# EAGLE design Gateway HUB (EAGLE 9.6.2)
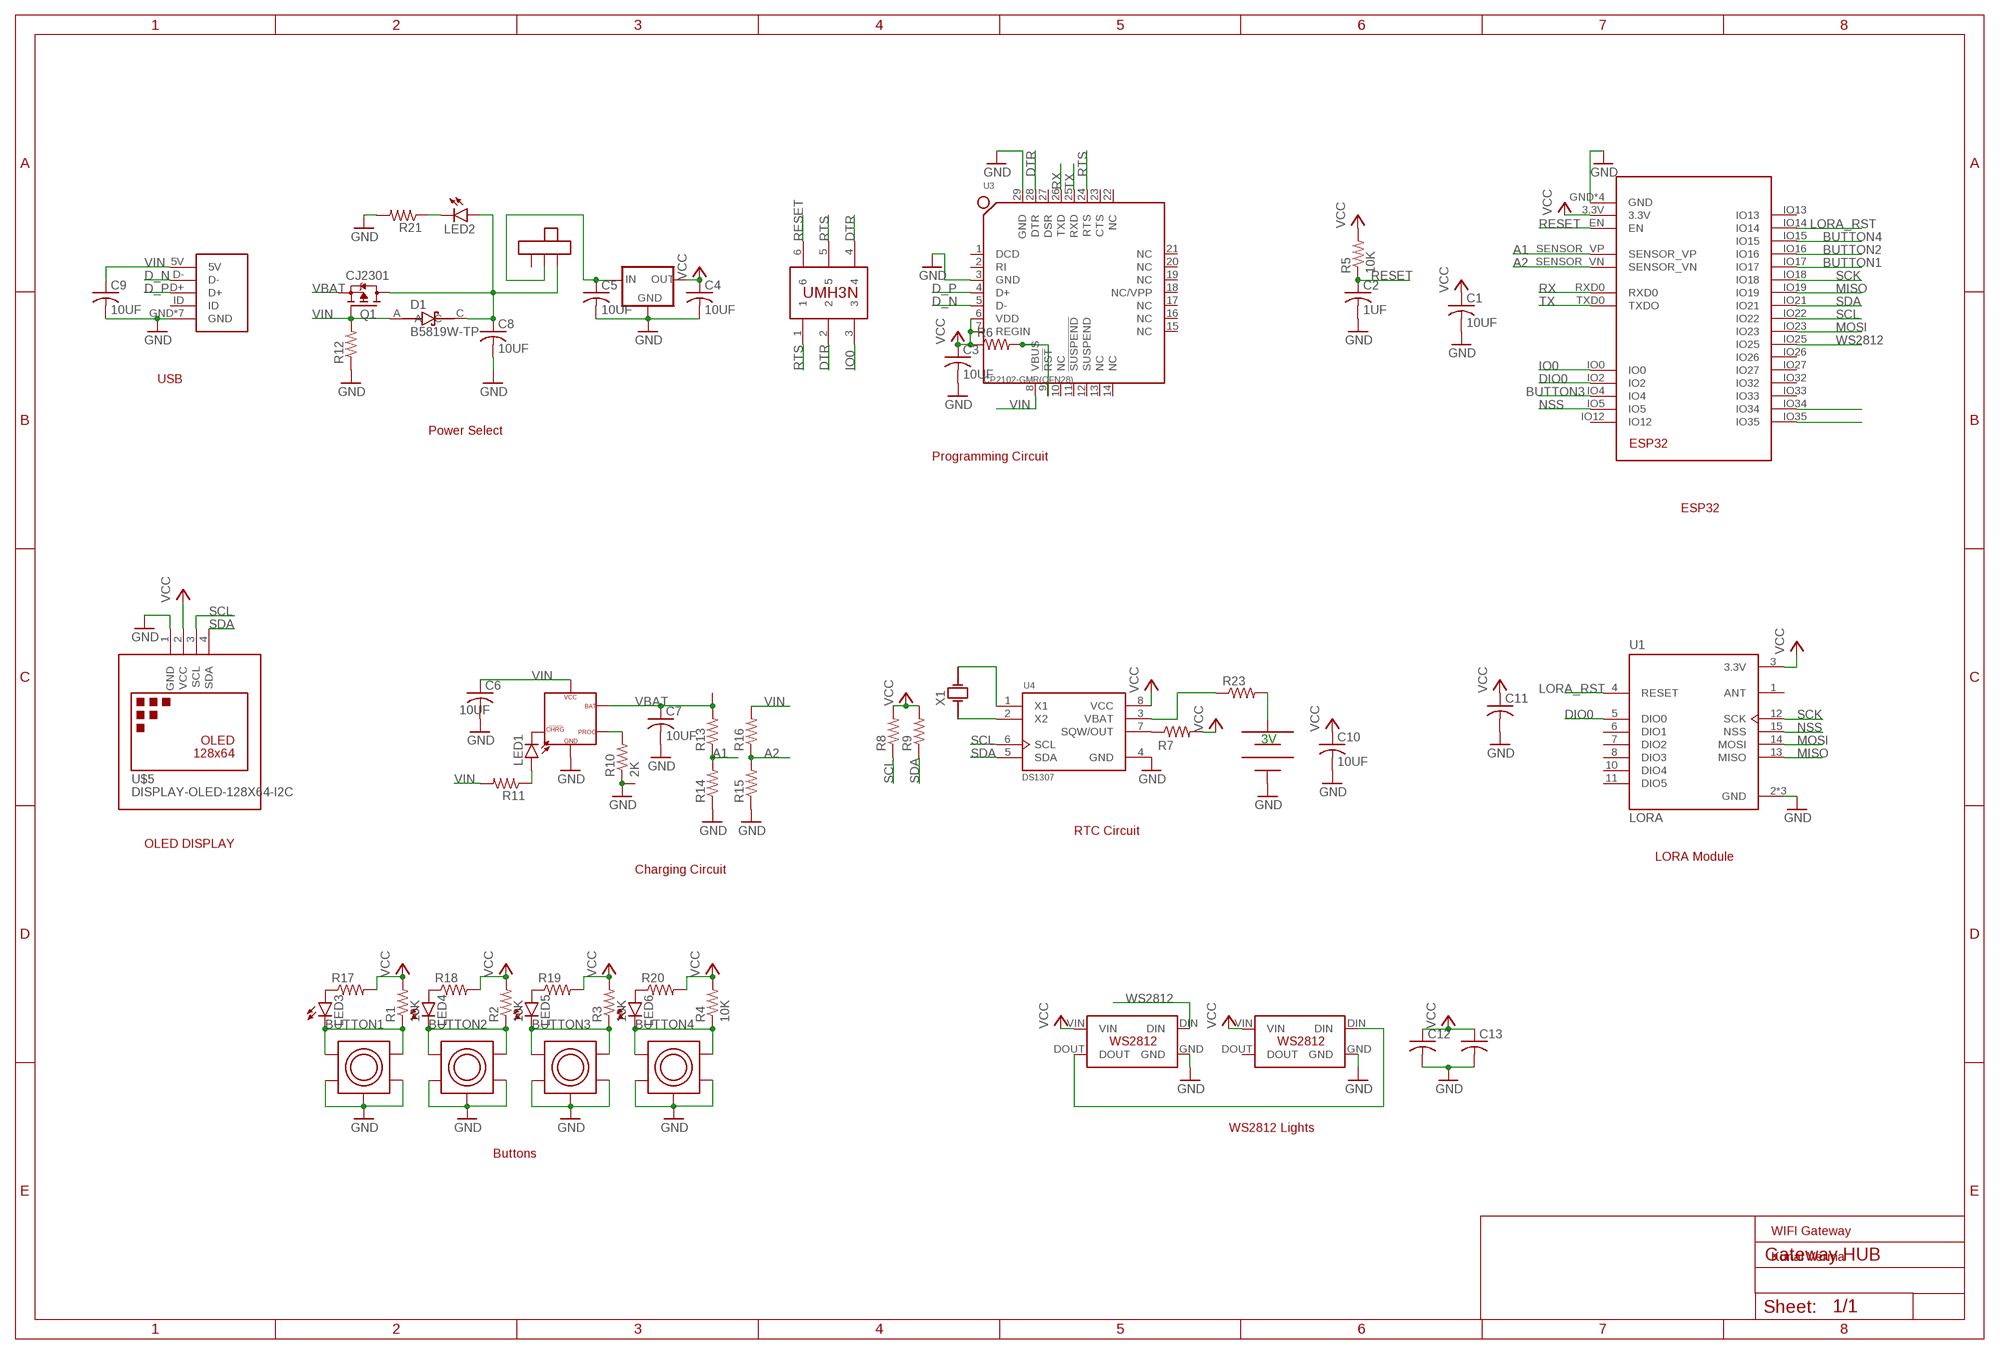
[diagram p0: schematic, sheet 1]

## Parts
C1  10UF  C-USC0603  [C0603]
C2  1UF  C-USC0603  [C0603]
C3  10UF  C-USC0603  [C0603]
C4  10UF  C-USC0603  [C0603]
C5  10UF  C-USC0603  [C0603]
C6  10UF  C-USC0603  [C0603]
C7  10UF  C-USC0603  [C0603]
C8  10UF  C-USC0603  [C0603]
C9  10UF  C-USC0603  [C0603]
C10  10UF  C-USC0603  [C0603]
C11  C-USC0603  [C0603]
C12  C-USC0603  [C0603]
C13  C-USC0603  [C0603]
D1  B5819W-TP  [SOD3716X135N]
IC1  V_REG3.3MP  [SOT223]
LED1  LEDSML0603  [SML0603]
LED2  LEDSML0603  [SML0603]
LED3  LEDSML0603  [SML0603]
LED4  LEDSML0603  [SML0603]
LED5  LEDSML0603  [SML0603]
LED6  LEDSML0603  [SML0603]
Q1  CJ2301  [SOT95P230X110-3N]
R1  10K  R-US_R0603  [R0603]
R2  10K  R-US_R0603  [R0603]
R3  10K  R-US_R0603  [R0603]
R4  10K  R-US_R0603  [R0603]
R5  10K  R-US_R0603  [R0603]
R6  R-US_R0603  [R0603]
R7  R-US_R0603  [R0603]
R8  R-US_R0603  [R0603]
R9  R-US_R0603  [R0603]
R10  2K  R-US_R0603  [R0603]
R11  R-US_R0603  [R0603]
R12  R-US_R0603  [R0603]
R13  R-US_R0603  [R0603]
R14  R-US_R0603  [R0603]
R15  R-US_R0603  [R0603]
R16  R-US_R0603  [R0603]
R17  R-US_R0603  [R0603]
R18  R-US_R0603  [R0603]
R19  R-US_R0603  [R0603]
R20  R-US_R0603  [R0603]
R21  R-US_R0603  [R0603]
R23  R-US_R0603  [R0603]
U1  LORA  [XCVR_RA-01H]
U2  ESP32  [MODULE_ESP-WROOM-32]
U3  CP2102-GMR(QFN28)  [QFN28G_0.5-5X5MM]
U4  DS1307  [SOIC127P600X175-8N]
U5  TP4054  [SOT23-3]
U$1  PUSHBUTTON  [B3W-4105]
U$2  PUSHBUTTON  [B3W-4105]
U$3  PUSHBUTTON  [B3W-4105]
U$4  PUSHBUTTON  [B3W-4105]
U$5  DISPLAY-OLED-128X64-I2C  [DISPLAY-OLED-128X64-I2C]
U$6  COIN_CELL_HOLDER  [CR2032-BS-6-1]
U$7  UMH3N  [UMH3N]
U$8  MICROUSB  [USB]
U$9  SELF-TOOGLE-SWITCH  [SELF-TOOGLE-SWITCH]
U$10  PAD  [PADS]
U$11  PAD  [PADS]
U$12  WS2812SMD-2020  [SMD-2020]
U$13  WS2812SMD-2020  [SMD-2020]
X1  CRYSTAL_38T-32.768KHZ  [XTAL_AB38T-32.768KHZ]

## Nets
A1: R13.1 R14.2 U2.SENSOR_VP
A2: R15.2 R16.1 U2.SENSOR_VN
BUTTON1: LED3.C R1.1 U2.IO17 U$1.P$1 U$1.P$4
BUTTON2: LED4.C R2.1 U2.IO16 U$2.P$1 U$2.P$4
BUTTON3: LED5.C R3.1 U2.IO4 U$3.P$1 U$3.P$4
BUTTON4: LED6.C R4.1 U2.IO15 U$4.P$1 U$4.P$4
D_N: U3.5(D-) U$8.D-
D_P: U3.4(D+) U$8.D+
DIO0: U1.5(DIO0) U2.IO2
DTR: U3.28(DTR) U$7.2 U$7.4
GND: C1.2 C2.2 C3.2 C4.2 C5.2 C6.2 C7.2 C8.2 C9.2 C10.2 C11.2 C12.2 C13.2 IC1.GND R10.1 R12.1 R14.1 R15.1 R21.2 U1.2(GND) U1.9(GND) U1.16(GND) U2.GND U2.GND1(GND) U2.GND2(GND) U2.GND3(GND) U3.3(GND) U3.29(GND) U4.4(GND) U5.2 U$1.P$2 U$1.P$3 U$1.P$5 U$2.P$2 U$2.P$3 U$2.P$5 U$3.P$2 U$3.P$3 U$3.P$5 U$4.P$2 U$4.P$3 U$4.P$5 U$5.1(GND) U$6.- U$8.GND U$8.GND1(GND) U$8.GND2(GND) U$8.GND3(GND) U$8.GND4(GND) U$8.GND5(GND) U$8.GND6(GND) U$11.P$1 U$12.GND U$13.GND
IO0: U2.IO0 U$7.3
LORA_RST: U1.4(RESET) U2.IO14
MISO: U1.13(MISO) U2.IO19
MOSI: U1.14(MOSI) U2.IO23
N$1: R23.1 U4.3(VBAT)
N$2: R6.2 U3.9(!RST)
N$3: U2.IO34
N$4: U2.IO35
N$5: R7.1 U4.7(SQW/OUT)
N$6: C5.1 IC1.VIN(IN) U$9.2
N$7: U4.2(X2) X1.1
N$8: U4.1(X1) X1.2
N$9: R10.2 U5.5
N$10: LED1.C U5.1
N$11: C8.1 D1.C LED2.A Q1.3(D) U$9.3
N$12: LED1.A R11.1
N$13: LED3.A R17.1
N$14: LED4.A R18.1
N$15: LED5.A R19.1
N$16: LED6.A R20.1
N$17: LED2.C R21.1
N$18: U$12.DOUT U$13.DIN
N$19: R23.2 U$6.+
NSS: U1.15(NSS) U2.IO5
RESET: C2.1 R5.1 U2.EN U$7.6
RTS: U3.24(RTS) U$7.1 U$7.5
RX: U2.RXD0 U3.26(TXD)
SCK: U1.12(SCK) U2.IO18
SCL: R8.1 U2.IO22 U4.6(SCL) U$5.3(SCL)
SDA: R9.1 U2.IO21 U4.5(SDA) U$5.4(SDA)
TX: U2.TXD0(TXDO) U3.25(RXD)
VBAT: C7.1 Q1.2(S) R13.2 U5.3 U$10.P$1
VCC: C1.1 C3.1 C4.1 C10.1 C11.1 C12.1 C13.1 IC1.VOUT1(OUT) IC1.VOUT(OUT) R1.2 R2.2 R3.2 R4.2 R5.2 R6.1 R7.2 R8.2 R9.2 R17.2 R18.2 R19.2 R20.2 U1.3(3.3V) U2.3.3V U3.6(VDD) U3.7(REGIN) U4.8(VCC) U$5.2(VCC) U$12.VIN U$13.VIN
VIN: C6.1 C9.1 D1.A Q1.1(G) R11.2 R12.2 R16.2 U3.8(VBUS) U5.4 U$8.5V
WS2812: U2.IO25 U$12.DIN
Unconnected: U1.1(ANT) U1.6(DIO1) U1.7(DIO2) U1.8(DIO3) U1.10(DIO4) U1.11(DIO5) U2.IO12 U2.IO13 U2.IO26 U2.IO27 U2.IO32 U2.IO33 U3.1(DCD) U3.2(RI) U3.10(NC) U3.11(!SUSPEND) U3.12(SUSPEND) U3.13(NC) U3.14(NC) U3.15(NC) U3.16(NC) U3.17(NC) U3.18(NC/VPP) U3.19(NC) U3.20(NC) U3.21(NC) U3.22(NC) U3.23(CTS) U3.27(DSR) U$8.ID U$9.1 U$13.DOUT

## Notes on the sheet
- USB
- Power Select
- Programming Circuit
- ESP32
- 3V
- RTC Circuit
- OLED DISPLAY
- LORA Module
- Charging Circuit
- WS2812 Lights
- Buttons
- WIFI Gateway
- Kunal Verma

## Library data of the parts
C1-C13 = rcl:C-US: CAPACITOR, American symbol; SPICEPREFIX: C
D1 = B5819W-TP:B5819W-TP: Diode Schottky 20v 1a Sod123 Check availability <https://pricing.snapeda.com/parts/B5819W-TP/Micro%20Commercial/view-part?ref=eda>; AVAILABILITY: In Stock; DESCRIPTION: Diode Schottky 40 V 1A Surface Mount SOD-123; MF: Micro Commercial; MP: B5819W-TP; PACKAGE: SOD-123 Multicomp; PRICE: None; PURCHASE-URL: https://pricing.snapeda.com/search/part/B5819W-TP/?ref=eda
IC1 = V_REG:V_REG: 800mA Low-Dropout Linear Regulator Source: http://www.ti.com/lit/ds/symlink/lm1117-n.pdf; MF: Texas Instruments; MPN: LM1117MP-3.3; OC_FARNELL: 9778195; OC_NEWARK: 28X3416
LED1-LED6 = led:LED: LED OSRAM: - CHIPLED LG R971, LG N971, LY N971, LG Q971, LY Q971, LO R971, LY R971 LH N974, LH R974 LS Q976, LO Q976, LY Q976 LO Q996 - Hyper CHIPLED LW Q18S LB Q993, LB Q99A, LB R99A - SideLED LS A670, LO A670, LY A670, LG A670, LP A670 LB A673, LV A673, LT A673, LW A673 LH A674 LY A675 LS A676, LA A676, LO A676, LY A676, LW A676 LS A679, LY A679, LG A679 - Hyper Micro SIDELED® LS Y876, LA Y876, LO Y876, LY Y876 LT Y87S - SmartLED LW L88C, LW L88S LB L89C, LB L89S, LG L890 LS L89K, LO L89K, LY L89K LS L896, LA L896, LO L896, LY L896 - TOPLED LS T670, LO T670, LY T670, LG T670, LP T670 LSG T670, LSP T670, LSY T670, LOP T670, LYG T670 LG T671, LOG T671, LSG T671 LB T673, LV T673, LT T673, LW T673 LH T674 LS T676, LA T676, LO T676, LY T676, LB T676, LH T676, LSB T676, LW T676 LB T67C, LV T67C, LT T67C, LS T67K, LO T67K, LY T67K, LW E67C LS E67B, LA E67B, LO E67B, LY E67B, LB E67C, LV E67C, LT E67C LW T67C LS T679, LY T679, LG T679 LS T770, LO T770, LY T770, LG T770, LP T770 LB T773, LV T773, LT T773, LW T773 LH T774 LS E675, LA E675, LY E675, LS T675 LS T776, LA T776, LO T776, LY T776, LB T776 LHGB T686 LT T68C, LB T68C - Hyper Mini TOPLED® LB M676 - Mini TOPLED Santana® LG M470 LS M47K, LO M47K, LY M47K Source: http://www.osram.convergy.de LUXEON: - LUMILED® LXK2-PW12-R00, LXK2-PW12-S00, LXK2-PW14-U00, LXK2-PW14-V00 LXK2-PM12-R00, LXK2-PM12-S00, LXK2-PM14-U00 LXK2-PE12-Q00, LXK2-PE12-R00, LXK2-PE12-S00, LXK2-PE14-T00, LXK2-PE14-U00 LXK2-PB12-K00, LXK2-PB12-L00, LXK2-PB12-M00, LXK2-PB14-N00, LXK2-PB14-P00, LXK2-PB14-Q00 LXK2-PR12-L00, LXK2-PR12-M00, LXK2-PR14-Q00, LXK2-PR14-R00 LXK2-PD12-Q00, LXK2-PD12-R00, LXK2-PD12-S00 LXK2-PH12-R00, LXK2-PH12-S00 LXK2-PL12-P00, LXK2-PL12-Q00, LXK2-PL12-R00 Source: www.luxeon.com KINGBRIGHT: KA-3528ASYC Source: www.kingbright.com
Q1 = PMV65XP_215:CJ2301: Single P-Channel 20 V 833 mW 7.7 nC Silicon Surface Mount Mosfet - SOT-23 Check availability <https://pricing.snapeda.com/parts/PMV65XP%2C215/Nexperia%20USA%20Inc./view-part?ref=eda>; AVAILABILITY: In Stock; DESCRIPTION: P-Channel 20 V 2.8A (Ta) 480mW (Ta) Surface Mount TO-236AB; MF: Nexperia USA Inc.; MP: PMV65XP,215; PACKAGE: SOT23-3 Nexperia USA Inc.; PRICE: None; PURCHASE-URL: https://pricing.snapeda.com/search/part/PMV65XP,215/?ref=eda
R1-R21 R23 = rcl:R-US_: RESISTOR, American symbol; SPICEPREFIX: R
U1 = RA-01H:LORA: Ai-Thinker Lora Series Module Check availability <https://pricing.snapeda.com/parts/RA-01H/AI-Thinker/view-part?ref=eda>; AVAILABILITY: Not in stock; DESCRIPTION: Ai-Thinker Lora Series Module; MF: AI-Thinker; MP: RA-01H; PACKAGE: Package; PRICE: None
U2 = ESP-WROOM-32:ESP32: Module: combo; GPIO, I2C x2, I2S x2, SDIO, SPI x3, UART x3; 19.5dBm
U3 = CP2102-GMR_QFN28_:CP2102-GMR(QFN28): 310070003 Check prices <https://pricing.snapeda.com/parts/CP2102-GMR/Silicon/view-part?ref=eda>; AVAILABILITY: Warning; DESCRIPTION: USB Bridge, USB to UART USB 2.0 UART Interface 28-QFN (5x5); MF: Silicon; MP: CP2102-GMR; PACKAGE: VFQFN-28 Vishay Siliconix; PRICE: None; PURCHASE-URL: https://pricing.snapeda.com/search/part/CP2102-GMR/?ref=eda
U4 = DS1307Z:DS1307: Real Time Clock Serial 56Byte 8-Pin SOIC N Check availability <https://pricing.snapeda.com/parts/DS1307Z/Maxim%20Integrated/view-part?ref=eda>; AVAILABILITY: In Stock; DESCRIPTION: Real Time Clock (RTC) IC Clock/Calendar 56B I²C, 2-Wire Serial 8-SOIC (0.154, 3.90mm Width); MF: Maxim Integrated; MP: DS1307Z; PACKAGE: SOIC-8 Maxim; PRICE: None; PURCHASE-URL: https://pricing.snapeda.com/search/part/DS1307Z/?ref=eda
U5 = TP4054-V2:TP4054: RT9193 Series 300 mA 3.3 V Ultra-Low Noise Ultra-Fast CMOS LDO Regulator-SC-70-5 Check prices <https://pricing.snapeda.com/parts/RT9193-33GB/Richtek%20USA/view-part?ref=eda>; AVAILABILITY: Bad; DESCRIPTION: Linear Voltage Regulator IC Positive Fixed 1 Output 300mA SOT-23-5; MF: Richtek USA; MP: RT9193-33GB; PACKAGE: SOT-23-5 Richtek; PRICE: None
U$1-U$4 = push-button b3w4105:PUSHBUTTON
U$5 = diy-modules:DISPLAY-OLED-128X64-I2C: 128x64 Dot Matrix OLED Module based on SSD1306 chip Variant with I2C interface More details available here: http://www.instructables.com/id/Monochrome-096-i2c-OLED-display-with-arduino-SSD13/ SSD1306 datasheet: https://cdn-shop.adafruit.com/datasheets/SSD1306.pdf Click here to find device on ebay.com <http://www.ebay.com/sch/oled+display+128x64+iic> Note: There are two variants: I2C and SPI. Search for the proper version.
U$6 = COIN CELL HOLDER:COIN_CELL_HOLDER
U$7 = UMH3N:UMH3N
U$8 = micro usb:MICROUSB
U$9 = SELF-TOOGLE-SWITCH:SELF-TOOGLE-SWITCH
U$10 U$11 = pad:PAD
U$12 U$13 = WS2812:WS2812
X1 = AB38T-32.768KHZ:CRYSTAL_38T-32.768KHZ: AB38T Series 32.768 kHz ±20 ppm 12.5 pF -10 to +60 °C Tuning Fork Crystal Check availability <https://pricing.snapeda.com/parts/AB38T-32.768KHZ/Abracon/view-part?ref=eda>; AVAILABILITY: In Stock; DESCRIPTION: 32.768 kHz ±15ppm Crystal 12.5pF 30 kOhms Cylindrical Can, Radial; MF: Abracon; MP: AB38T-32.768KHZ; PACKAGE: Cylindrical Can Radial Abracon; PRICE: None; PURCHASE-URL: https://pricing.snapeda.com/search/part/AB38T-32.768KHZ/?ref=eda

## Board
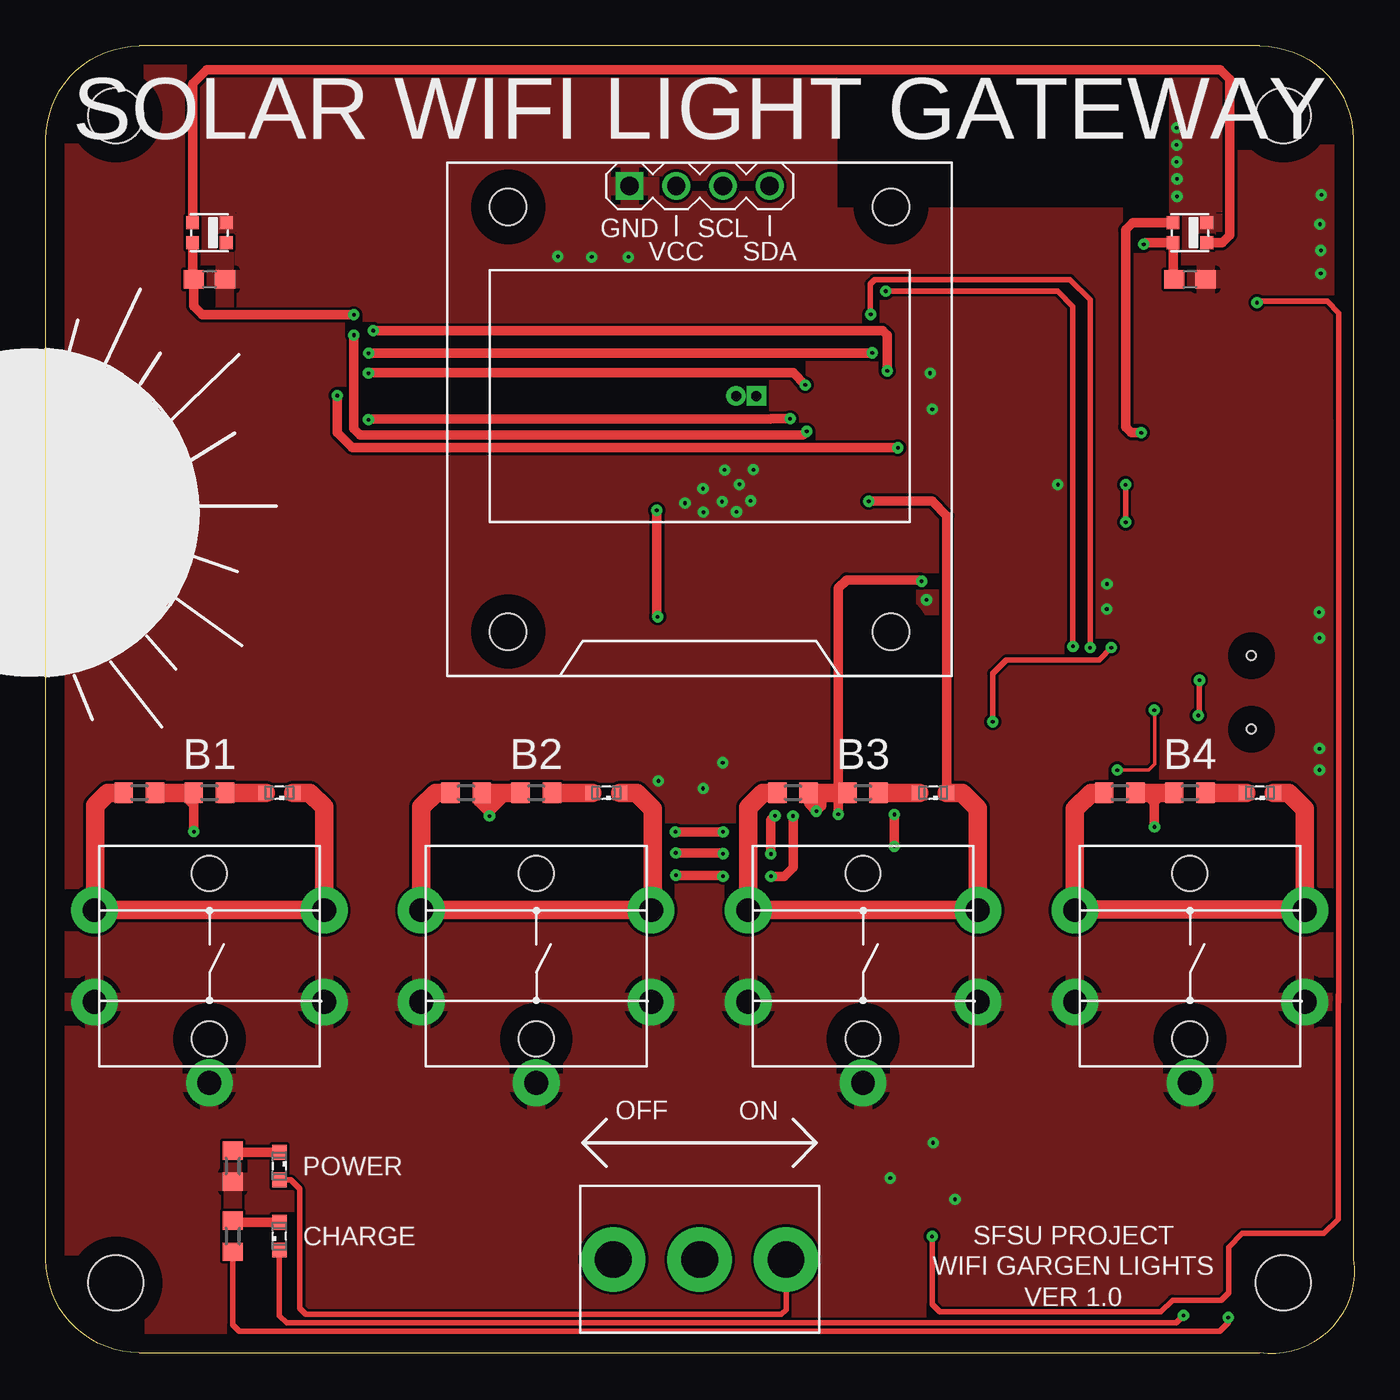
[diagram p1: board, top side]
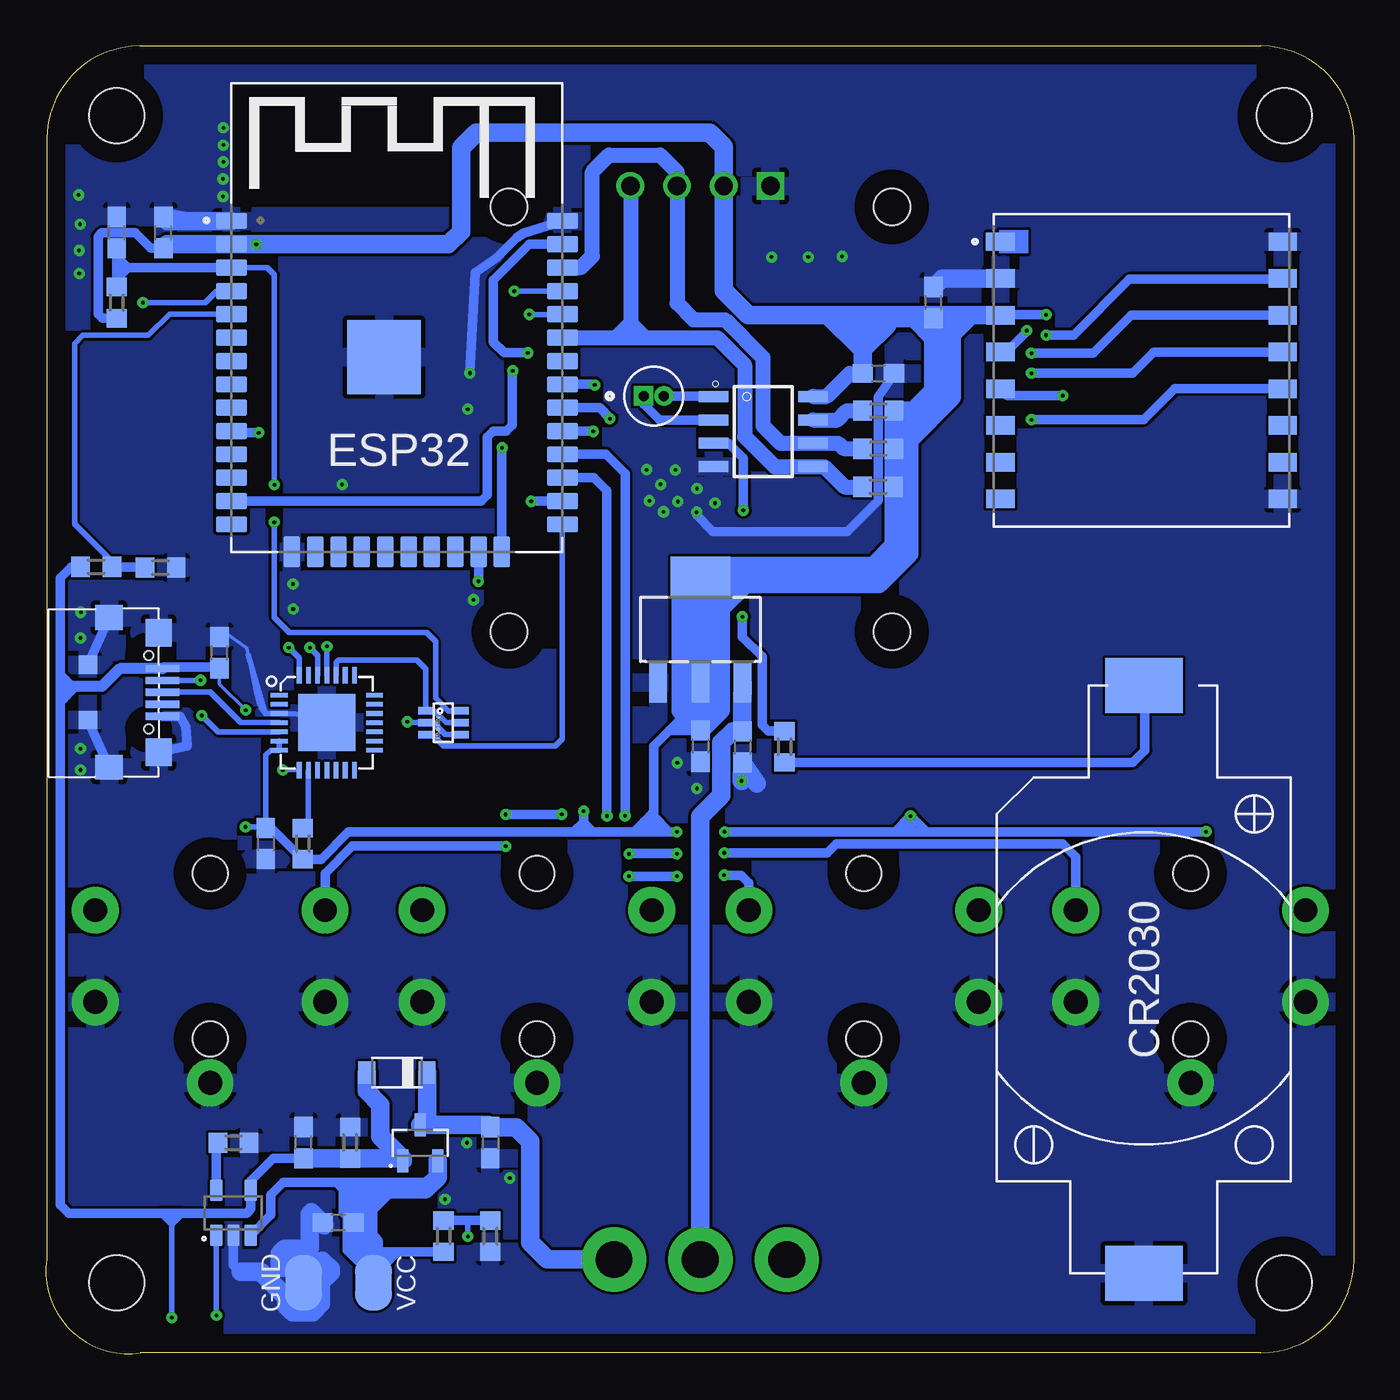
[diagram p2: board, bottom side, seen from below]

Size 71.16 x 71.16 mm. Coordinates in mm from the lower left corner, seen from the top.
Outline: 5.08,0.04 66.04,0.04 arc106 71.12,5.12 71.12,66.08 arc90 66.04,71.16 5.08,71.16 arc90 0,66.08 0,5.12 arc90 5.08,0.04
Copper layers (1*16): Top 0.035mm / dielectric 1.5mm / Bottom 0.035mm
Design rules "default *": minimum track width 6mil, minimum drill 0.35mm, track to track 6mil, track to pad 6mil, pad to pad 6mil, via to via 6mil, smd to smd 6mil, copper to edge 40mil, drill to drill 6mil, minimum pad ring 10mil, minimum via ring 8mil, stop-mask expansion 4mil, vias tented up to drill 100mil, thermal gap 10mil
Holes 3 mm at 3.81,67.35 67.31,67.35 3.81,3.85 67.31,3.85

### Footprints (pad centres in the part's own frame; a part is rotated, then mirrored left to right if it is on the bottom)
C0603 = smd 1.1 x 1: 1 -0.85,0; 2 0.85,0
SOD3716X135N = smd 0.914 x 1.219: A 1.638,0; C -1.638,0
SOT223 = smd 0.95 x 2.15: GND -2.3,-2.9; VIN 2.3,-2.9; VOUT 0,-2.9 | smd 3.25 x 2.15: VOUT1 0,2.9
SML0603 = smd 0.8 x 0.8: A 0.75,0; C -0.75,0
SOT95P230X110-3N = smd 0.59 x 1.26: 1 -0.95,-0.98; 2 0.95,-0.98; 3 0,0.98
R0603 = smd 1 x 1.1: 1 -0.85,0; 2 0.85,0
XCVR_RA-01H = smd 1.536 x 1: 1 -7.682,7; 2 -7.682,5; 3 -7.682,3; 4 -7.682,1; 5 -7.682,-1; 6 -7.682,-3; 7 -7.682,-5; 8 -7.682,-7; 9 7.682,-7; 10 7.682,-5; 11 7.682,-3; 12 7.682,-1; 13 7.682,1; 14 7.682,3; 15 7.682,5; 16 7.682,7
MODULE_ESP-WROOM-32 = smd 1.7 x 0.9: 3.3V -9,6.985; EN -9,5.715; GND -9,8.255; GND3 9,8.255; IO0 9,-8.255; IO4 9,-6.985; IO5 9,-3.175; IO12 -9,-8.255; IO14 -9,-6.985; IO16 9,-5.715; IO17 9,-4.445; IO18 9,-1.905; IO19 9,-0.635; IO21 9,1.905; IO22 9,5.715; IO23 9,6.985; IO25 -9,-3.175; IO26 -9,-4.445; IO27 -9,-5.715; IO32 -9,-0.635; IO33 -9,-1.905; IO34 -9,1.905; IO35 -9,0.635; NC 9,0.635; RXD0 9,3.175; SENSOR_VN -9,3.175; SENSOR_VP -9,4.445; TXD0 9,4.445 | smd 0.9 x 1.7: CLK 0.635,-9.755; CMD -0.635,-9.755; GND2 -5.715,-9.755; IO2 5.715,-9.755; IO13 -4.445,-9.755; IO15 4.445,-9.755; SD0 1.905,-9.755; SD1 3.175,-9.755; SD2 -3.175,-9.755; SD3 -1.905,-9.755 | smd 4 x 4: GND1 -0.7,0.845
QFN28G_0.5-5X5MM = smd 0.9 x 0.254: 1 -2.59,1.5; 2 -2.59,1; 3 -2.59,0.5; 4 -2.59,0; 5 -2.59,-0.5; 6 -2.59,-1; 7 -2.59,-1.5; 15 2.59,-1.5; 16 2.59,-1; 17 2.59,-0.5; 18 2.59,0; 19 2.59,0.5; 20 2.59,1; 21 2.59,1.5 | smd 0.254 x 0.9: 8 -1.5,-2.59; 9 -1,-2.59; 10 -0.5,-2.59; 11 0,-2.59; 12 0.5,-2.59; 13 1,-2.59; 14 1.5,-2.59; 22 1.5,2.59; 23 1,2.59; 24 0.5,2.59; 25 0,2.59; 26 -0.5,2.59; 27 -1,2.59; 28 -1.5,2.59 | smd 3.1 x 3.1: 29 0,0
SOIC127P600X175-8N = smd 1.6 x 0.6: 1 -2.7,1.905; 2 -2.7,0.635; 3 -2.7,-0.635; 4 -2.7,-1.905; 5 2.7,-1.905; 6 2.7,-0.635; 7 2.7,0.635; 8 2.7,1.905
SOT23-3 = smd 1.17 x 0.67: 1 -1.22,0.94; 2 -1.22,0; 3 -1.22,-0.94; 4 1.22,-0.94; 5 1.22,0.94
B3W-4105 = drill 1.3 pad 2.54: P$1 6.25,2.5; P$2 6.25,-2.5; P$3 -6.25,-2.5; P$4 -6.25,2.5; P$5 0,-6.9 | hole 1.9: 0,4.5; 0,-4.5
DISPLAY-OLED-128X64-I2C = drill 1 square: 1 -3.81,12.7 | drill 1: 2 -1.27,12.7; 3 1.27,12.7; 4 3.81,12.7 | hole 2: -10.414,11.557; 10.414,11.557; 10.414,-11.557; -10.414,-11.557
CR2032-BS-6-1 = smd 3 x 4.2: + 16,0; - -16,0
UMH3N = smd 0.4 x 0.8: 1 -0.65,-0.97; 2 0,-0.97; 3 0.65,-0.97; 4 0.65,0.97; 5 0,0.97; 6 -0.65,0.97
USB = smd 0.4 x 1.8: 5V -1.298,0.204; D+ 0.002,0.204; D- -0.648,0.204; GND 1.302,0.204; ID 0.652,0.204 | smd 1.5 x 1.4: GND1 3.25,0; GND6 -3.25,0 | smd 1.35 x 1.5: GND2 4.075,-2.7; GND5 -4.075,-2.7 | smd 1 x 1: GND3 1.5,-3.85; GND4 -1.5,-3.85 | hole 0.5: -2,-0.55; 2,-0.55
SELF-TOOGLE-SWITCH = drill 2 pad 3.5: 1 -4.7,0; 2 0,0; 3 4.7,0
PADS = smd 3 x 2: P$1 0,1.27
SMD-2020 = smd 0.7 x 0.7: DIN -0.915,0.55; DOUT 0.915,-0.55; GND 0.915,0.55; VIN -0.915,-0.55
XTAL_AB38T-32.768KHZ = drill 0.55 pad 0.925 square: 1 -0.55,0 | drill 0.55 pad 0.925: 2 0.55,0

### Placement (x,y rotation side)
C1  64.77,61 90 bottom
C2  67.31,61 90 bottom
C3  59.21,27.76 270 bottom
C4  35.56,33.06 270 bottom
C5  33.27,33.01 270 bottom
C6  57.15,11.47 90 bottom
C7  55.26,7.13 180 bottom
C8  46.99,11.47 270 bottom
C9  61.72,38.14 90 bottom
C10  25.88,53.33 0 bottom
C11  22.88,57.19 90 bottom
C12  62.23,58.46 0 top
C13  8.89,58.46 0 top
D1  52.07,15.28 180 bottom
IC1  35.56,39.41 0 bottom
LED1  12.7,6.39 90 top
LED2  12.7,10.2 270 top
LED3  12.7,30.52 180 top
LED4  30.48,30.52 180 top
LED5  48.26,30.52 180 top
LED6  66.04,30.52 180 top
Q1  50.8,11.47 0 bottom
R1  5.08,30.52 0 top
R2  22.86,30.52 0 top
R3  40.64,30.52 0 top
R4  58.42,30.52 0 top
R5  67.31,57.19 270 bottom
R6  57.19,27.75 90 bottom
R7  25.88,51.31 0 bottom
R8  25.89,49.24 0 bottom
R9  25.89,47.16 0 bottom
R10  60.96,11.47 180 bottom
R11  10.16,6.39 270 top
R12  54.61,11.47 270 bottom
R13  49.53,6.39 270 bottom
R14  46.99,6.39 90 bottom
R15  64.92,42.77 180 bottom
R16  68.43,42.81 180 bottom
R17  8.89,30.52 180 top
R18  26.67,30.52 180 top
R19  44.45,30.52 180 top
R20  62.23,30.52 180 top
R21  10.16,10.2 270 top
R23  30.98,33.02 270 bottom
U1  11.56,53.51 0 bottom
U2  52.07,53.38 0 bottom
U3  55.88,34.33 0 bottom
U4  32.14,50.17 0 bottom
U5  60.96,7.66 90 bottom
U$1  8.89,21.63 0 top
U$2  26.67,21.63 0 top
U$3  44.45,21.63 0 top
U$4  62.23,21.63 0 top
U$5  35.56,50.84 0 top
U$6  11.43,20.36 90 bottom
U$7  49.53,34.33 270 bottom
U$8  65.02,35.98 270 bottom
U$9  35.56,5.12 0 top
U$10  52.07,3.85 90 bottom
U$11  58.42,3.85 270 bottom
U$12  62.23,61 0 top
U$13  8.89,61 0 top
X1  38.1,52.11 0 bottom

### Tracks (layer width: path | path; a pad name or v marks a point on that pad's centre or on a via)
A1  (via drill 0.2 pad 0.2)
  Top 0.305: v48.21,6.37 48.21,2.68 48.63,2.26 60.66,2.26 61.3,2.9 63.93,2.9 64.33,3.3 64.33,5.79 65.08,6.54 69.52,6.54 70.3,7.31 70.3,19.09 | 70.3,19.52 70.3,19.09 | 70.3,19.09 70.34,19.14 70.34,50.84 | 70.34,51.46 70.34,50.84 | 70.34,50.84 70.34,56.63 69.71,57.26 65.95,57.26 v65.88,57.19
  Bottom 0.305: 48.26,7.24 48.21,7.19 v48.21,6.37 | v65.88,57.19 62.5,57.19 61.87,57.83 U2.SENSOR_VP
  Bottom 0.508: R14.2 48.26,7.24 R13.1
A2
  Bottom 0.305: R16.1 67.58,43.12 69.6,45.14 69.6,54.96 69.15,55.41 65.58,55.41 64.44,56.56 U2.SENSOR_VN
  Bottom 0.508: R15.2 65.81,42.81 R16.1
BUTTON1  (via drill 0.2 pad 0.2)
  Top 0.508: v34.26,27.24 36.8,27.24 v36.84,27.21 | v39.44,27.19 39.44,29.05 v39.66,29.27
  Top 1.016: U$1.P$4 2.67,24.16 | 2.67,24.16 2.67,29.83 3.36,30.52 R1.1 | LED3.C 14.35,30.52 15.14,29.73 U$1.P$1 2.71,24.13 2.67,24.16
  Bottom 0.508: U$1.P$1 15.14,27.04 15.84,27.73 28.16,27.73 28.65,27.24 v34.26,27.24 | v36.84,27.21 39.43,27.21 v39.44,27.19 | v39.66,29.27 39.66,47.9 40.7,48.94 U2.IO17
BUTTON2  (via drill 0.2 pad 0.2)
  Top 0.508: v34.27,26.03 36.78,26.03 v36.83,25.97 | v39.44,25.97 40.17,25.97 40.64,26.44 v40.64,29.26
  Top 1.016: R2.1 21.2,30.52 20.42,29.75 U$2.P$4 U$2.P$1 32.98,24.13 33.02,24.17 33.02,29.64 32.14,30.52 LED4.C
  Bottom 0.508: U$2.P$1 32.92,25.62 33.33,26.03 v34.27,26.03 | v36.83,25.97 v39.44,25.97 | v40.64,29.26 40.64,46.96 41.35,47.67 U2.IO16
BUTTON3  (via drill 0.2 pad 0.2)
  Top 0.508: LED5.C 49.01,45.58 48.2,46.38 v44.76,46.38
  Top 1.016: R3.1 39,30.52 38.2,29.72 U$3.P$4 U$3.P$1 50.7,29.67 49.85,30.52 LED5.C
  Bottom 0.508: v44.76,46.38 43.08,46.38 U2.IO4
BUTTON4  (via drill 0.2 pad 0.2)
  Top 0.508: v46.15,27.61 46.15,29.33 v46.16,29.34 | v43.11,29.35 43.11,41.65 43.55,42.1 47.56,42.1 v47.64,42.03
  Top 1.016: R4.1 56.85,30.52 55.98,29.65 U$4.P$4 56.02,24.17 68.44,24.17 U$4.P$1 68.48,29.65 67.6,30.52 LED6.C
  Bottom 0.508: U$4.P$4 55.98,26.13 54.49,27.62 46.15,27.62 v46.15,27.61 | v46.16,29.34 43.12,29.34 v43.11,29.35 | v47.64,42.03 47.62,42.04 U2.IO15
D_N  (via drill 0.2 pad 0.1, 0.2 pad 0.2)
  Top 0.305: v62.75,36.64 62.74,36.63 62.74,34.73 v62.68,34.73
  Bottom 0.305: U$8.D- 62.76,36.63 v62.75,36.64 | U3.5 61.79,33.84 v62.68,34.73
D_P
  Bottom 0.305: U3.4 60.56,34.33 62.22,35.99 U$8.D+
DIO0  (via drill 0.2 pad 0.2)
  Top 0.508: v15.85,52.13 15.85,50.11 16.65,49.31 46.33,49.31 v46.34,49.29
  Bottom 0.508: U1.5 18.87,52.13 v15.85,52.13 | v46.34,49.29 46.36,49.28 U2.IO2
DTR  (via drill 0.2 pad 0.2)
  Top 0.305: v57.95,38.42 57.29,37.76 52.24,37.76 51.5,37.02 v51.5,34.38
  Bottom 0.305: U3.28 57.38,37.84 v57.95,38.42 | v51.5,34.38 51.45,34.33 U$7.2 50.09,34.33 49.45,33.68 U$7.4
GND  (via drill 0.2 pad 0.2)
  Bottom 0.2: U3.3 57.53,34.83 56.76,34.83 56.64,34.78 56.3,34.62 | 59.45,35.14 59.6,35.34 59.66,35.62 59.67,35.66 59.72,35.84 60.16,38.03 60.23,38.38 61.18,39.08 C9.2
  Bottom 0.305: 59.22,34.83 U3.3 56.64,34.78 | 59.22,34.83 59.45,35.14 | 59.22,34.83 60.16,38.03 | U3.29 56.3,34.62
  Bottom 0.508: U5.2 60.96,4.83 60.57,4.44 | U2.GND3 45.18,60.97 45.54,60.72 46.63,59.63 47.81,58.82 v48.1,53.36 | U$8.GND5 U$8.GND4 | U$8.GND3 U$8.GND2 | U$8.GND 63.84,34.67 63.54,34.13 63.47,33.05 64.71,32.8 U$8.GND1 | C10.2 25.83,52.12 25.89,52.06 25.89,46.41 27.56,44.75 34.89,44.75 35.76,45.62 v35.76,45.78
  Bottom 1.016: U2.GND 63.5,61.64 | 63.5,61.64 64.55,61.64 C1.2 63.5,61.64 | U1.2 22.41,58.51 C11.2 | U$11.P$1 57.96,4.66 58.44,4.66 58.44,5.43 58.18,5.69 | 58.18,5.69 56.86,5.69 56.82,5.73 56.82,7.57 56.72,7.68 56.03,6.99 | U$11.P$1 58.18,4.88 58.18,5.69 | U$11.P$1 57.15,4.04 56.13,5.06 55.68,4.6 55.68,4.41 56.2,3.88 56.2,2.7 56.65,2.26 57.75,2.26 58.1,2.61 58.1,3.05 59.49,4.44 60.57,4.44 | 32.48,31.01 C5.2 v33.32,31.16
  other vias: 48.26,11.47 45.93,9.55 49.46,8.39 55.05,47.29 57.72,41.88 57.71,40.51 47.9,41.02 38.48,48.1 36.92,48.08 37.72,47.3 38.33,46.41 36.78,46.37 35.74,47.07 34.76,46.28 37.57,45.81 31.69,59.67 29.69,59.67 27.85,59.7 48.22,51.39 36.82,32.15 35.75,30.75 69.28,32.92 69.28,31.76 69.28,38.94 69.26,40.34 69.35,58.78 69.36,60.04 69.3,61.46 69.38,63.05 61.53,62.97 61.53,63.92 61.51,64.85 61.51,65.77 61.51,66.7
  pour Top: 76.2,0.04 76.2,72.43 -3.81,72.43 -3.81,-1.23 76.2,-1.23
  pour Bottom: 81.28,-3.77 81.28,76.24 -7.62,76.24 -7.62,-7.58 81.28,-7.58
IO0
  Bottom 0.305: U$7.3 50.15,33.68 49.53,33.06 43.47,33.06 43.07,33.46 U2.IO0
LORA_RST  (via drill 0.2 pad 0.2)
  Top 0.508: v17.81,55.67 44.89,55.67 45.52,55.67 45.77,55.42 v45.77,53.48
  Bottom 0.508: U1.4 18.93,54.51 17.79,55.65 v17.81,55.67 | v45.77,53.48 45.79,53.46 45.79,50.52 46.11,50.2 46.84,50.2 47.16,49.88 47.16,46.72 47.48,46.4 U2.IO14
MISO  (via drill 0.2 pad 0.2)
  Top 0.508: v41.3,52.71 40.64,53.37 17.57,53.37 v17.54,53.35
  Bottom 0.508: U2.IO19 41.34,52.75 v41.3,52.71 | v17.54,53.35 12.04,53.35 10.88,54.51 U1.13
MOSI  (via drill 0.2 pad 0.2)
  Top 0.508: v17.55,54.44 44.92,54.44 v44.95,54.46
  Bottom 0.508: U1.14 12.11,56.51 14.18,54.44 v17.55,54.44 | v44.95,54.46 46.24,54.46 46.82,55.04 46.82,58.41 44.86,60.37 U2.IO23
N$1  (via drill 0.2 pad 0.2)
  Top 0.508: v33.22,45.89 33.22,40.15 v33.28,40.1
  Bottom 0.508: U4.3 34.04,49.54 33.23,48.72 v33.23,45.89 v33.22,45.89 | v33.28,40.1 33.28,39 32.2,37.93 32.2,34.22 31.86,33.87 R23.1
N$2
  Bottom 0.305: U3.9 56.88,28.9 R6.2
N$5
  Bottom 0.813: U4.7 28.09,50.81 27.59,51.31 R7.1
N$6
  Bottom 1.016: U$9.2 35.56,29.23 34.42,30.38 34.42,33.25 33.81,33.86 C5.1 33.27,35.9 33.26,35.91 IC1.VIN
N$7
  Bottom 0.508: U4.2 37.78,50.81 38.65,51.68 X1.1
N$8
  Bottom 0.508: U4.1 34.87,52.11 X1.2
N$9
  Bottom 0.508: U5.5 61.9,11.38 R10.2
N$10  (via drill 0.2 pad 0.2)
  Top 0.305: LED1.C 12.7,2.07 13.09,1.67 61.48,1.67 v61.89,2.08
  Bottom 0.305: v61.89,2.08 61.89,6.43 U5.1
N$11
  Top 0.305: U$9.3 40.26,2.4 40,2.14 14.12,2.14 13.8,2.45 13.8,8.97 13.32,9.45 LED2.A
  Bottom 1.016: U$9.3 43.9,5.12 44.82,6.04 44.82,11.56 45.58,12.32 C8.1 47.12,12.45 Q1.3 50.43,12.82 D1.C
N$12
  Top 0.508: LED1.A 10.26,7.14 R11.1
N$13
  Top 1.016: R17.1 LED3.A
N$14
  Top 1.016: R18.1 LED4.A
N$15
  Top 1.016: R19.1 LED5.A
N$16
  Top 1.016: R20.1 LED6.A
N$17
  Top 0.508: LED2.C 10.26,10.95 R21.1
N$18
  Top 0.508: U$13.DIN 7.98,69.1 8.74,69.87 63.88,69.87 64.41,69.34 64.41,60.87 63.99,60.45 U$12.DOUT
N$19
  Bottom 0.508: R23.2 12.04,32.17 11.38,32.83 11.38,36.31 U$6.+
NSS  (via drill 0.2 pad 0.2)
  Top 0.508: v16.75,55.43 16.75,50.33 17.1,49.98 41.18,49.98 v41.39,50.19
  Bottom 0.508: U1.15 3.92,58.46 12.23,58.46 15.26,55.43 v16.75,55.43 | v41.39,50.19 41.41,50.21 U2.IO5
RESET  (via drill 0.2 pad 0.2)
  Top 0.305: v58.74,45.24 v58.74,47.28 v58.73,47.28
  Bottom 0.305: U$7.6 49.27,34.98 49.96,35.67 49.96,38.74 50.45,39.24 57.93,39.24 58.74,40.05 v58.74,45.24 | v58.73,47.28 58.73,58.7 59.13,59.1 U2.EN
  Bottom 0.508: U2.EN 66.7,59.1 | 66.7,59.1 67.13,59.1 67.31,59.28 C2.1 | C2.1 67.31,58.46 | 67.31,58.46 R5.1 | 67.31,58.46 66.7,59.07 66.7,59.1 | C2.1 67.31,59.7 66.7,59.1
RTS
  Bottom 0.305: U3.24 55.38,37.62 55.24,37.76 50.98,37.76 50.49,37.26 50.49,34.99 U$7.1 50.03,34.98 49.38,34.33 U$7.5
RX  (via drill 0.2 pad 0.2)
  Top 0.305: v56.8,38.42 56.8,57.35 55.71,58.44 45.08,58.44 44.84,58.2 44.84,56.58 v44.87,56.55
  Bottom 0.305: U3.26 56.38,38 v56.8,38.42 | v44.87,56.55 U2.RXD0
SCK  (via drill 0.2 pad 0.2)
  Top 0.508: v17.55,50.82 17.58,50.85 39.41,50.85 39.43,50.87 v40.48,50.87
  Bottom 0.508: U1.12 9.76,52.51 11.44,50.83 17.53,50.83 v17.55,50.82 | U2.IO18 41.04,51.48 40.48,50.92 v40.48,50.87
SCL
  Bottom 0.813: U2.IO22 42.05,59.1 41.44,59.71 41.44,64.31 40.54,65.22 37.75,65.22 36.83,64.3 U$5.3 36.83,57.15 35.94,56.26 34.22,56.26 32.16,54.2 32.16,50.49 31.21,49.54 U4.6 28.06,49.54 27.77,49.25 R8.1
SDA
  Bottom 0.813: U2.IO21 40.14,55.29 | 40.14,55.29 39.78,55.29 | 39.78,55.29 39.34,55.72 39.34,56.05 | 39.34,56.08 39.34,63.51 U$5.4 | 39.78,55.29 38.58,55.29 | 38.58,55.29 34.63,55.29 33.15,53.8 33.15,49.9 31.52,48.27 U4.5 28.81,48.27 27.71,47.17 R9.1 | 40.14,55.29 39.34,56.08 | 39.34,56.08 39.34,56.05 | 39.34,56.05 38.58,55.29
TX  (via drill 0.2 pad 0.2)
  Top 0.305: v55.87,38.48 55.87,56.99 55.04,57.82 v45.69,57.82
  Bottom 0.305: U3.25 v55.88,38.47 v55.87,38.48 | v45.69,57.82 v45.68,57.83 U2.TXD0
VBAT
  Bottom 0.508: U5.3 58.92,7.54 58.92,8.65 58.25,9.31 55.36,9.31 | 55.36,9.31 54.98,9.31 | 54.98,9.31 54.76,9.31 | 54.76,9.31 54.61,9.31 | 54.61,9.31 53.91,9.31 | 53.91,9.31 53.45,9.31 | 53.45,9.31 50.13,9.31 50.13,9.32 | C7.1 54.41,7.35 | 54.41,7.35 54.41,8.19 54.41,8.96 54.76,9.31 | 54.61,9.31 54.61,7.55 54.41,7.35 | C7.1 54.78,7.49 | 54.78,7.49 54.98,7.7 54.98,8.93 | 54.98,8.93 54.98,9.31 | C7.1 53.91,7.63 | 53.91,7.63 53.91,7.66 53.91,8.93 53.91,9.31 | 53.91,7.63 53.91,6.62 53.72,6.43 | 54.78,7.49 54.78,5.62 54.07,4.91 53.44,5.54 52.76,5.54 | 53.83,8.93 53.45,9.31 | 54.98,8.93 55.36,9.31 | R13.2 52.07,5.54 | 52.76,5.54 52.07,5.54 | 52.76,5.54 53.13,5.17 | 53.13,5.17 53.34,4.96 | 52.07,5.54 52.28,5.33 52.44,5.17 | 52.44,5.17 52.76,5.17 | 52.76,5.17 53.13,5.17 | U$10.P$1 52.76,4.43 52.76,4.85 | 52.76,4.85 52.76,5.17 | 52.44,5.17 52.76,4.85
  Bottom 1.016: 53.62,6.34 53.72,6.43 C7.1 54.46,7.08 54.46,6.02 53.34,4.9 U$10.P$1 53.34,4.96 53.34,6.06 53.62,6.34 | Q1.2 49.85,9.6 50.13,9.32 | 50.13,9.31 50.52,8.93 52.73,8.93 | 52.73,8.93 53.83,8.93 | 53.91,8.93 53.83,8.93 | 53.83,8.93 54.41,8.35 54.41,8.19 | 53.91,7.66 53.62,7.94 | 53.62,7.94 52.73,8.84 52.73,8.93 | 53.62,7.94 53.62,6.34
VCC  (via drill 0.2 pad 0.2)
  Top 0.305: v60.3,28.65 60.3,29.84 | 60.3,29.84 60.3,30.12 60.3,30.46 60.36,30.52 | 59.63,30.52 60.3,29.84 | 60.3,29.84 60.88,30.42 60.88,30.52 | 42.02,30.52 41.91,30.41 v41.91,29.51 41.6,29.82 | 42.19,30.23 42.34,30.39 | 41.49,30.03 R3.2 41.6,30.41 41.6,29.82 | 41.91,29.95 42.19,30.23 | 42.19,29.79 42.19,29.94 42.19,30.23 | 41.49,29.93 41.6,29.82 | C13.1 7.98,58.53
  Top 0.508: v36.84,28.39 v34.24,28.39 | v8.05,28.4 8.04,28.41 8.04,29.84 | 8.04,29.84 R17.2 | v24.13,29.25 24.13,30.52 | v24.13,29.25 24.13,29.86 24.8,30.52 | v24.13,29.25 24.13,29.39 23.51,30.02 | v24.13,29.25 24.13,29.47 25.18,30.52 | 7.36,30.52 8.04,29.84 | v41.91,29.51 41.91,29.66 42.19,29.94 | 42.48,30.52 42.34,30.39 41.91,29.95 v41.91,29.51 | v41.91,29.51 41.49,29.93 41.49,30.03 | 42.19,29.79 v41.91,29.51 | v60.3,28.65 60.3,30.12 | U$13.VIN 7.98,58.53 | C13.1 8.04,57 8.51,56.53 v16.75,56.53 | C12.1 61.31,58.53 U$12.VIN 59.8,60.45 v59.72,60.37
  Top 1.016: R1.2 7.36,30.52 R17.2 | R2.2 24.13,30.52 24.8,30.52 25.18,30.52 R18.2 | R3.2 42.02,30.52 42.48,30.52 R19.2 | R4.2 59.63,30.52 60.36,30.52 60.88,30.52 R20.2
  Bottom 0.305: U3.6 U3.7 58.94,32.83 59.21,32.56 C3.1 59.24,28.65 v60.3,28.65 | v41.91,29.51 41.91,28.38
  Bottom 0.508: C1.1 65.45,60.15 66.3,61 68.12,61 68.33,60.79 68.33,56.57 68.1,56.34 R5.2 | C4.1 36.83,33.91 | 36.83,33.91 37.25,33.91 | 37.25,33.91 38.1,33.06 38.1,29.46 | 38.31,29.25 38.21,29.36 | 38.21,29.36 38.1,29.46 | 39.19,28.38 41.38,28.38 | 41.38,28.38 41.91,28.38 42.44,28.38 | 42.44,28.38 54.71,28.38 56.19,26.9 R6.1 58.9,28.61 C3.1 | 39.19,28.38 38.1,28.38 | 38.1,28.38 36.86,28.38 v36.84,28.39 37.24,28.39 38.1,29.25 | v34.24,28.39 24.99,28.39 | 24.99,28.39 24.13,28.39 | 24.13,28.39 23.26,28.39 | 23.26,28.39 v8.06,28.39 v8.05,28.4 | 24.13,28.39 v24.13,29.25 | v24.13,29.25 24.11,29.25 23.26,28.39 | v24.13,29.25 24.99,28.39 | 41.91,28.9 v41.91,29.51 41.91,28.9 | 41.91,28.9 42.44,28.38 | 41.91,28.9 41.38,28.38 | 38.1,29.46 38.1,29.25 | 38.21,29.36 38.1,29.25 | 38.1,29.04 38.1,29.25 | 38.1,29.25 38.31,29.25 | 39.19,28.38 38.63,28.94 | 38.63,28.94 38.31,29.25 | 38.31,29.25 38.1,29.04 | 38.1,29.04 38.1,28.41 | 38.1,28.38 38.1,28.41 | 38.1,28.41 38.63,28.94 | 37.25,33.91 36.53,34.63 | 36.53,34.63 36.28,34.63 | 36.83,33.91 36.53,34.21 36.53,34.63 | v16.75,56.53 19.22,56.53 U1.3
  Bottom 0.813: U4.8 28.7,52.08 27.44,53.33 C10.1
  Bottom 1.016: C4.1 35.56,35.64 | 35.56,35.64 35.56,36.14 | IC1.VOUT 35.56,39.74 | 35.56,39.74 IC1.VOUT1 | IC1.VOUT 35.56,39.06 | 36.64,40.14 36.64,41.74 36.3,41.74 36.28,41.73 36.28,40.46 35.56,39.74 | 36.64,40.14 36.37,39.87 | 36.37,39.87 35.56,39.06 | 35.56,39.06 35.38,39.06 | 34.44,41.46 34.44,40.56 | 34.44,40.56 34.44,40 | 34.44,41.46 34.93,41.46 34.95,41.45 34.95,40.03 35.24,39.74 35.56,39.74 | 35.38,39.06 34.44,40 | 34.44,40 34.44,37.26 | 34.44,37.26 35.56,36.14 | IC1.VOUT 35.56,36.14 | IC1.VOUT 35.38,36.69 35.38,39.06 | 34.44,37.26 34.44,35.9 | C4.1 34.44,35.03 34.44,35.9 | 34.44,35.9 34.71,35.64 35.56,35.64 | C4.1 36.28,34.63 | 36.28,34.63 36.64,34.99 36.64,35.35 | 36.64,35.35 36.64,39.6 | 36.64,39.6 36.64,40.14 | 36.37,39.87 36.64,39.6 | 35.56,39.74 36.09,39.21 36.09,35.9 | 36.09,35.9 36.64,35.35 | 36.09,35.9 36.09,34.82 36.28,34.63 | C1.1 64.55,60.37 U2.3.3V v59.72,60.37 49.28,60.37 48.58,61.07 48.58,65.64 47.77,66.45 35.05,66.45 34.29,65.69 U$5.2 34.29,57.85 32.95,56.51 28.62,56.51 | 26.14,56.51 26.71,56.51 | 26.71,56.51 27.47,56.51 | 27.47,56.51 27.94,56.51 | 27.94,56.51 28.62,56.51 | C10.1 26.73,54.65 | 26.73,55.92 26.73,54.65 | 26.73,55.92 26.73,56.49 26.71,56.51 | 26.73,55.92 26.89,55.92 27.31,56.34 | 26.73,55.92 26.14,56.51 | 21.59,56.51 22.71,56.51 | 22.71,56.51 C11.1 | C11.1 23.93,56.34 | 23.93,56.34 25.4,56.34 | 27.31,56.34 25.4,56.34 | 27.31,56.34 27.47,56.51 | 26.14,56.51 22.71,56.51 | 26.73,55.92 25.82,55.92 25.4,56.34 | 25.4,56.34 25.4,55.98 26.73,54.65 | 26.73,54.65 27.94,55.86 27.94,56.51 | 26.73,54.65 26.76,54.65 28.62,56.51 | 22.88,55.29 22.88,52.38 23.95,51.31 R7.2 R8.2 R9.2 25.04,43.96 26.13,42.87 34.27,42.87
  Bottom 1.016: 22.88,55.29 C11.1 | 24.19,49.72 24.19,50.4 23.55,50.4 21.88,52.08 | 21.88,52.08 21.88,55.48 | 21.88,55.48 21.88,56.22 21.59,56.51 | 21.59,56.51 U1.3 | 20.82,56.51 20.85,56.51 21.88,55.48 | 22.88,55.29 23.93,56.34 | 21.88,52.08 21.88,52.04 24.19,49.72 | 34.44,41.46 34.02,41.88 33.13,41.88 | 24.19,49.72 24.19,43.55 25.86,41.88 33.13,41.88 | 33.13,41.88 34.44,40.56
VIN  (via drill 0.2 pad 0.2)
  Top 0.2: v58.28,31.75 59.98,31.75 60.31,32.08 60.31,34.99 v60.29,35.01
  Top 0.305: R11.2 10.16,1.55 10.5,1.21 63.85,1.21 64.32,1.67 v64.32,1.96
  Bottom 0.2: U3.8 58.27,31.74 v58.28,31.75 | v60.29,35.01 61.72,36.45 C9.1
  Bottom 0.305: v64.32,1.96 64.32,7.04 | 64.32,7.04 64.32,7.61 64.35,7.64 | 64.91,7.64 | 64.32,7.04 64.91,7.64 | 64.91,7.64 63.83,7.64 63.83,7.54 64.32,7.04
  Bottom 0.508: U$8.5V 64.75,37.35 61.79,37.35 C9.1 | 70.38,35.53 70.08,35.83 70.08,35.84 70.08,36.64 | 70.38,35.53 70.38,8.09 69.93,7.64 64.91,7.64 64.35,7.64 63.83,7.64 60.24,7.64 60.02,7.86 U5.4 60.02,9.4 58.8,10.62 C6.1 | R16.2 69.78,42.81 70.38,42.21 70.38,36.95 | 70.38,36.95 70.38,35.53 | 69.61,36.3 69.74,36.3 70.08,36.64 | 70.08,36.64 70.38,36.95
  Bottom 0.61: U$8.5V 67.14,37.28 68.11,36.3 69.61,36.3 70.08,35.83 70.3,35.61
  Bottom 1.016: C6.1 R12.2 51.88,10.62 Q1.1 51.75,10.6 52.97,11.82 52.97,13.55 53.71,14.28 D1.A
WS2812  (via drill 0.2 pad 0.2)
  Top 0.508: U$12.DIN 59.13,61.55 58.73,61.15 58.73,50.43 59.05,50.11 v59.58,50.11
  Bottom 0.508: v59.58,50.11 61.57,50.11 61.59,50.13 61.51,50.21 U2.IO25

### Text on the board
tPlace: SOLAR WIFI LIGHT GATEWAY | B1 | B2 | B3 | B4 | OFF | ON | POWER | CHARGE | SFSU PROJECT | WIFI GARGEN LIGHTS | VER 1.0
bPlace: VCC | GND